# EAGLE schematic BAM_Reference_R2_0 (EAGLE 6.6.0)
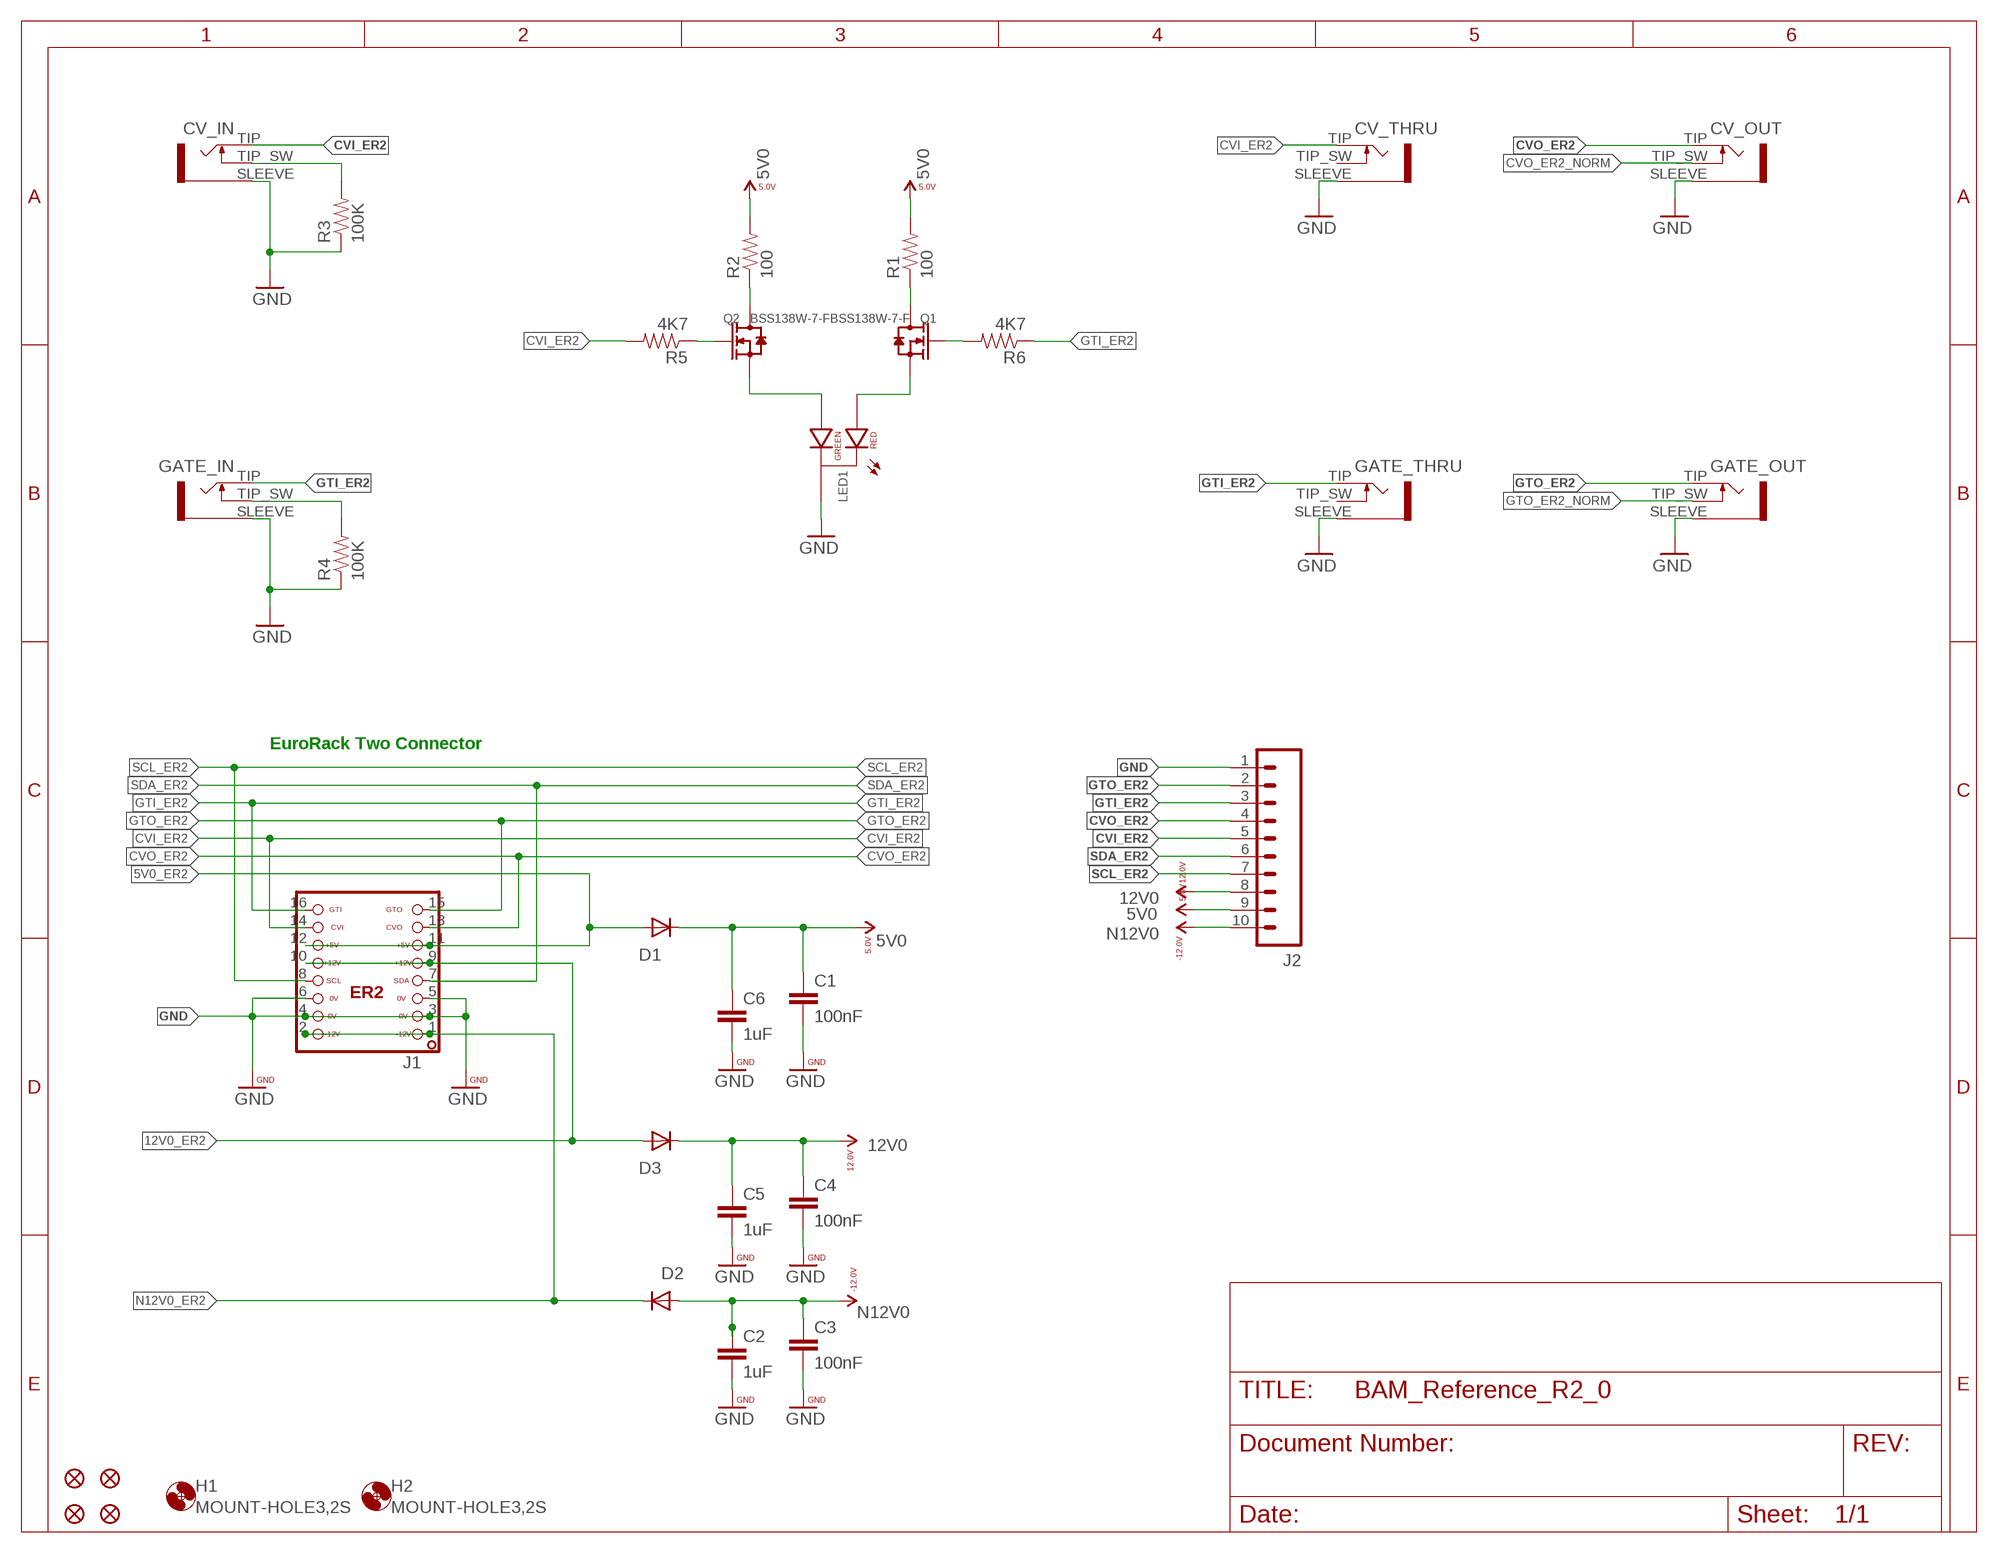
[diagram p0: schematic, sheet 1]

## Parts
C1  100nF  CAP0603-CAP  [0603-CAP]
C2  1uF  CAP0603-CAP  [0603-CAP]
C3  100nF  CAP0603-CAP  [0603-CAP]
C4  100nF  CAP0603-CAP  [0603-CAP]
C5  1uF  CAP0603-CAP  [0603-CAP]
C6  1uF  CAP0603-CAP  [0603-CAP]
CV_IN  JACK-3_5MM-MONO-SW-MJ_3502  [MJ-3502]
CV_OUT  JACK-3_5MM-MONO-SW-MJ_3502  [MJ-3502]
CV_THRU  JACK-3_5MM-MONO-SW-MJ_3502  [MJ-3502]
D1  1N5819HW  DIODE-SOD123  [SOD123]
D2  1N5819HW  DIODE-SOD123  [SOD123]
D3  1N5819HW  DIODE-SOD123  [SOD123]
FID1  FIDUCIALUFIDUCIAL  [MICRO-FIDUCIAL]
FID2  FIDUCIALUFIDUCIAL  [MICRO-FIDUCIAL]
FID3  FIDUCIALUFIDUCIAL  [MICRO-FIDUCIAL]
FID4  FIDUCIALUFIDUCIAL  [MICRO-FIDUCIAL]
GATE_IN  JACK-3_5MM-MONO-SW-MJ_3502  [MJ-3502]
GATE_OUT  JACK-3_5MM-MONO-SW-MJ_3502  [MJ-3502]
GATE_THRU  JACK-3_5MM-MONO-SW-MJ_3502  [MJ-3502]
H1  MOUNT-HOLE3,2S  [3,2,SMALL]
H2  MOUNT-HOLE3,2S  [3,2,SMALL]
J1  ER2-SHROUD  [ER2]
J2  M10SILK_FEMALE_PTH  [1X10_OCTO]
LED1  LED-RG-CC-PTH-G18500  [LED-RG-PANEL]
Q1  BSS138W-7-F  SMD-MOSFET-N-CH-50V-200MA-BSS138W-7-F(SOT-23)  [SOT-23]
Q2  BSS138W-7-F  SMD-MOSFET-N-CH-50V-200MA-BSS138W-7-F(SOT-23)  [SOT-23]
R1  100  RESISTOR0603  [0603-RES]
R2  100  RESISTOR0603  [0603-RES]
R3  100K  RESISTOR0603  [0603-RES]
R4  100K  RESISTOR0603  [0603-RES]
R5  4K7  RESISTOR0603  [0603-RES]
R6  4K7  RESISTOR0603  [0603-RES]

## Nets
5V0: C1.1 C6.1 D1.C J2.9 R1.2 R2.2
5V0_ER2: D1.A J1.11 J1.12
12V0: C4.1 C5.1 D3.C J2.8
12V0_ER2: D3.A J1.9 J1.10
CVI_ER2: CV_IN.TIP CV_THRU.TIP J1.14 J2.5 R5.2
CVO_ER2: CV_OUT.TIP J1.13 J2.4
CVO_ER2_NORM: CV_OUT.TIP_SW
GND: C1.2 C2.2 C3.2 C4.2 C5.2 C6.2 CV_IN.SLEEVE CV_OUT.SLEEVE CV_THRU.SLEEVE GATE_IN.SLEEVE GATE_OUT.SLEEVE GATE_THRU.SLEEVE J1.3 J1.4 J1.5 J1.6 J2.1 LED1.CC(CATHODE) R3.1 R4.1
GTI_ER2: GATE_IN.TIP GATE_THRU.TIP J1.16 J2.3 R6.1
GTO_ER2: GATE_OUT.TIP J1.15 J2.2
GTO_ER2_NORM: GATE_OUT.TIP_SW
N12V0: C2.1 C3.1 D2.A J2.10
N12V0_ER2: D2.C J1.1 J1.2
N$1: LED1.GREEN(GREEN_CATHODE) Q2.2(S)
N$2: LED1.RED(RED_CATHODE) Q1.2(S)
N$3: Q2.3(D) R2.1
N$4: Q1.3(D) R1.1
N$5: Q2.1(G) R5.1
N$6: Q1.1(G) R6.2
N$7: CV_IN.TIP_SW R3.2
N$8: GATE_IN.TIP_SW R4.2
SCL_ER2: J1.8 J2.7
SDA_ER2: J1.7 J2.6
Unconnected: CV_THRU.TIP_SW GATE_THRU.TIP_SW

## Notes on the sheet
- EuroRack Two Connector

## Library data of the parts
C1-C6 = oXo_Passives:CAP: Capacitor Standard 0603 ceramic capacitor, and 0.1" leaded capacitor.
CV_IN GATE_IN = oXo_Connectors:JACK-3_5MM-MONO-SW: Jack, 3.5mm, RIght Angle, Though-Hole
CV_OUT CV_THRU GATE_OUT GATE_THRU = halcyonmod_Connectors:JACK-3_5MM-MONO-SW: Jack, 3.5mm, RIght Angle, Though-Hole
D1-D3 = diode:DIODE-: DIODE
FID1-FID4 = TSOC-ESP8266-BASE:FIDUCIAL: Fiducial Alignment Points Various fiducial points for machine vision alignment.
H1 H2 = oXo_Hardware:MOUNT-HOLE: MOUNTING HOLE with drill center marker
J1 = EuroRack_R2_0:ER2: EuroRack2 - Backplane Connector
J2 = halcyonmod_Connectors:M10: Header 10 Standard 10-pin 0.1" header. Use with straight break away headers (SKU : PRT-00116), right angle break away headers (PRT-00553), swiss pins (PRT-00743), machine pins (PRT-00117), and female headers (PRT-00115).; PROD_ID: CONN-11563
LED1 = halcyonmod_Optoelectronics:LED-RG-CC-PTH: LED Red/Green Common Cathode Pin Through Hole
Q1 Q2 = Seeed-Transistor-2016:SMD-MOSFET-N-CH-50V-200MA-BSS138W-7-F(SOT-23): 305030000; MPN: BSS138W-7-F
R1-R6 = halcyonmod_Passives:RESISTOR: Resistor Basic schematic elements and footprints for 0603, 1206, and PTH resistors.

## Net classes
1 power: width 0.254 mm, drill 0.356 mm, clearance 0.178 mm